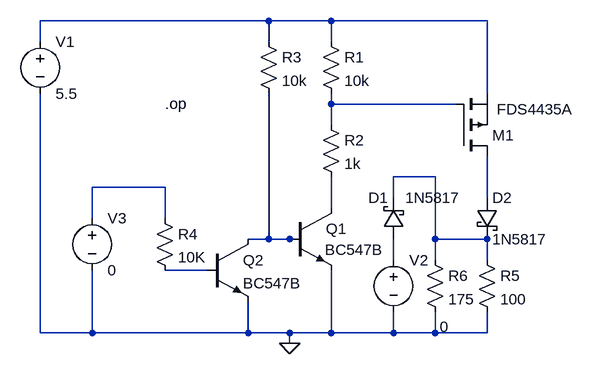
[diagram p0: schematic Power.asc]
Power.asc, the LTspice schematic file:
Version 4
SHEET 1 1024 680
WIRE 320 144 -32 144
WIRE 416 144 320 144
WIRE 656 144 416 144
WIRE -32 176 -32 144
WIRE 320 176 320 144
WIRE 416 176 416 144
WIRE 656 256 656 144
WIRE 416 272 416 256
WIRE 608 272 416 272
WIRE 416 304 416 272
WIRE 576 384 512 384
WIRE 160 400 48 400
WIRE 512 416 512 384
WIRE 656 416 656 352
WIRE 416 432 416 384
WIRE 48 448 48 400
WIRE 160 448 160 400
WIRE 320 480 320 256
WIRE 320 480 288 480
WIRE 352 480 320 480
WIRE 368 480 352 480
WIRE 576 480 576 384
WIRE 656 480 576 480
WIRE 512 512 512 480
WIRE 576 512 576 480
WIRE 656 512 656 480
WIRE 224 528 160 528
WIRE -32 624 -32 256
WIRE 48 624 48 528
WIRE 48 624 -32 624
WIRE 288 624 288 576
WIRE 288 624 48 624
WIRE 352 624 288 624
WIRE 416 624 416 528
WIRE 416 624 352 624
WIRE 512 624 512 592
WIRE 512 624 416 624
WIRE 576 624 576 592
WIRE 576 624 512 624
WIRE 656 624 656 592
WIRE 656 624 576 624
WIRE 352 640 352 624
FLAG 352 640 0
SYMBOL pmos 608 352 M180
WINDOW 3 63 72 Left 2
SYMATTR Value FDS4435A
SYMATTR InstName M1
SYMBOL npn 352 432 R0
WINDOW 3 54 64 Left 2
SYMATTR Value BC547B
SYMATTR InstName Q1
SYMBOL npn 224 480 R0
SYMATTR InstName Q2
SYMATTR Value BC547B
SYMBOL res 400 160 R0
SYMATTR InstName R1
SYMATTR Value 10k
SYMBOL res 400 288 R0
SYMATTR InstName R2
SYMATTR Value 1k
SYMBOL res 304 160 R0
SYMATTR InstName R3
SYMATTR Value 10k
SYMBOL res 144 432 R0
SYMATTR InstName R4
SYMATTR Value 10K
SYMBOL voltage -32 160 R0
SYMATTR InstName V1
SYMATTR Value 5.5
SYMBOL voltage 512 496 R0
WINDOW 3 71 119 Left 2
SYMATTR Value 0
SYMATTR InstName V2
SYMBOL schottky 528 480 R180
WINDOW 0 24 64 Left 2
WINDOW 3 -87 64 Left 2
SYMATTR InstName D1
SYMATTR Value 1N5817
SYMBOL schottky 640 416 R0
SYMATTR InstName D2
SYMATTR Value 1N5817
SYMBOL res 640 496 R0
SYMATTR InstName R5
SYMATTR Value 100
SYMBOL voltage 48 432 R0
SYMATTR InstName V3
SYMATTR Value 0
SYMBOL res 560 496 R0
SYMATTR InstName R6
SYMATTR Value 175
TEXT 160 272 Left 2 !.op

The netlist it stands for:
* Power.asc
M1 N005 N002 N001 N001 FDS4435A
Q1 N006 N007 0 0 BC547B
Q2 N007 N009 0 0 BC547B
R1 N001 N002 10k
R2 N002 N006 1k
R3 N001 N007 10k
R4 N004 N009 10K
V1 N001 0 5.5
V2 N008 0 0
D1 N008 N003 1N5817
D2 N005 N003 1N5817
R5 N003 0 100
V3 N004 0 0
R6 N003 0 175
.model D D
.lib standard.dio
.model NPN NPN
.model PNP PNP
.lib standard.bjt
.model NMOS NMOS
.model PMOS PMOS
.lib standard.mos
.op
.backanno
.end